# EasyEDA Pro project SMPS_V1.epro, schematic Schematic1_1
Board Name: Board1; Create Date: 2026-02-03; Page Name: HV PSU; Project Name: TL494-PSU-V1; Schematic Name: Schematic1; Update Date: 2026-02-19; Company: EasyEDA.com; Page Size: A4; Version: V1.0
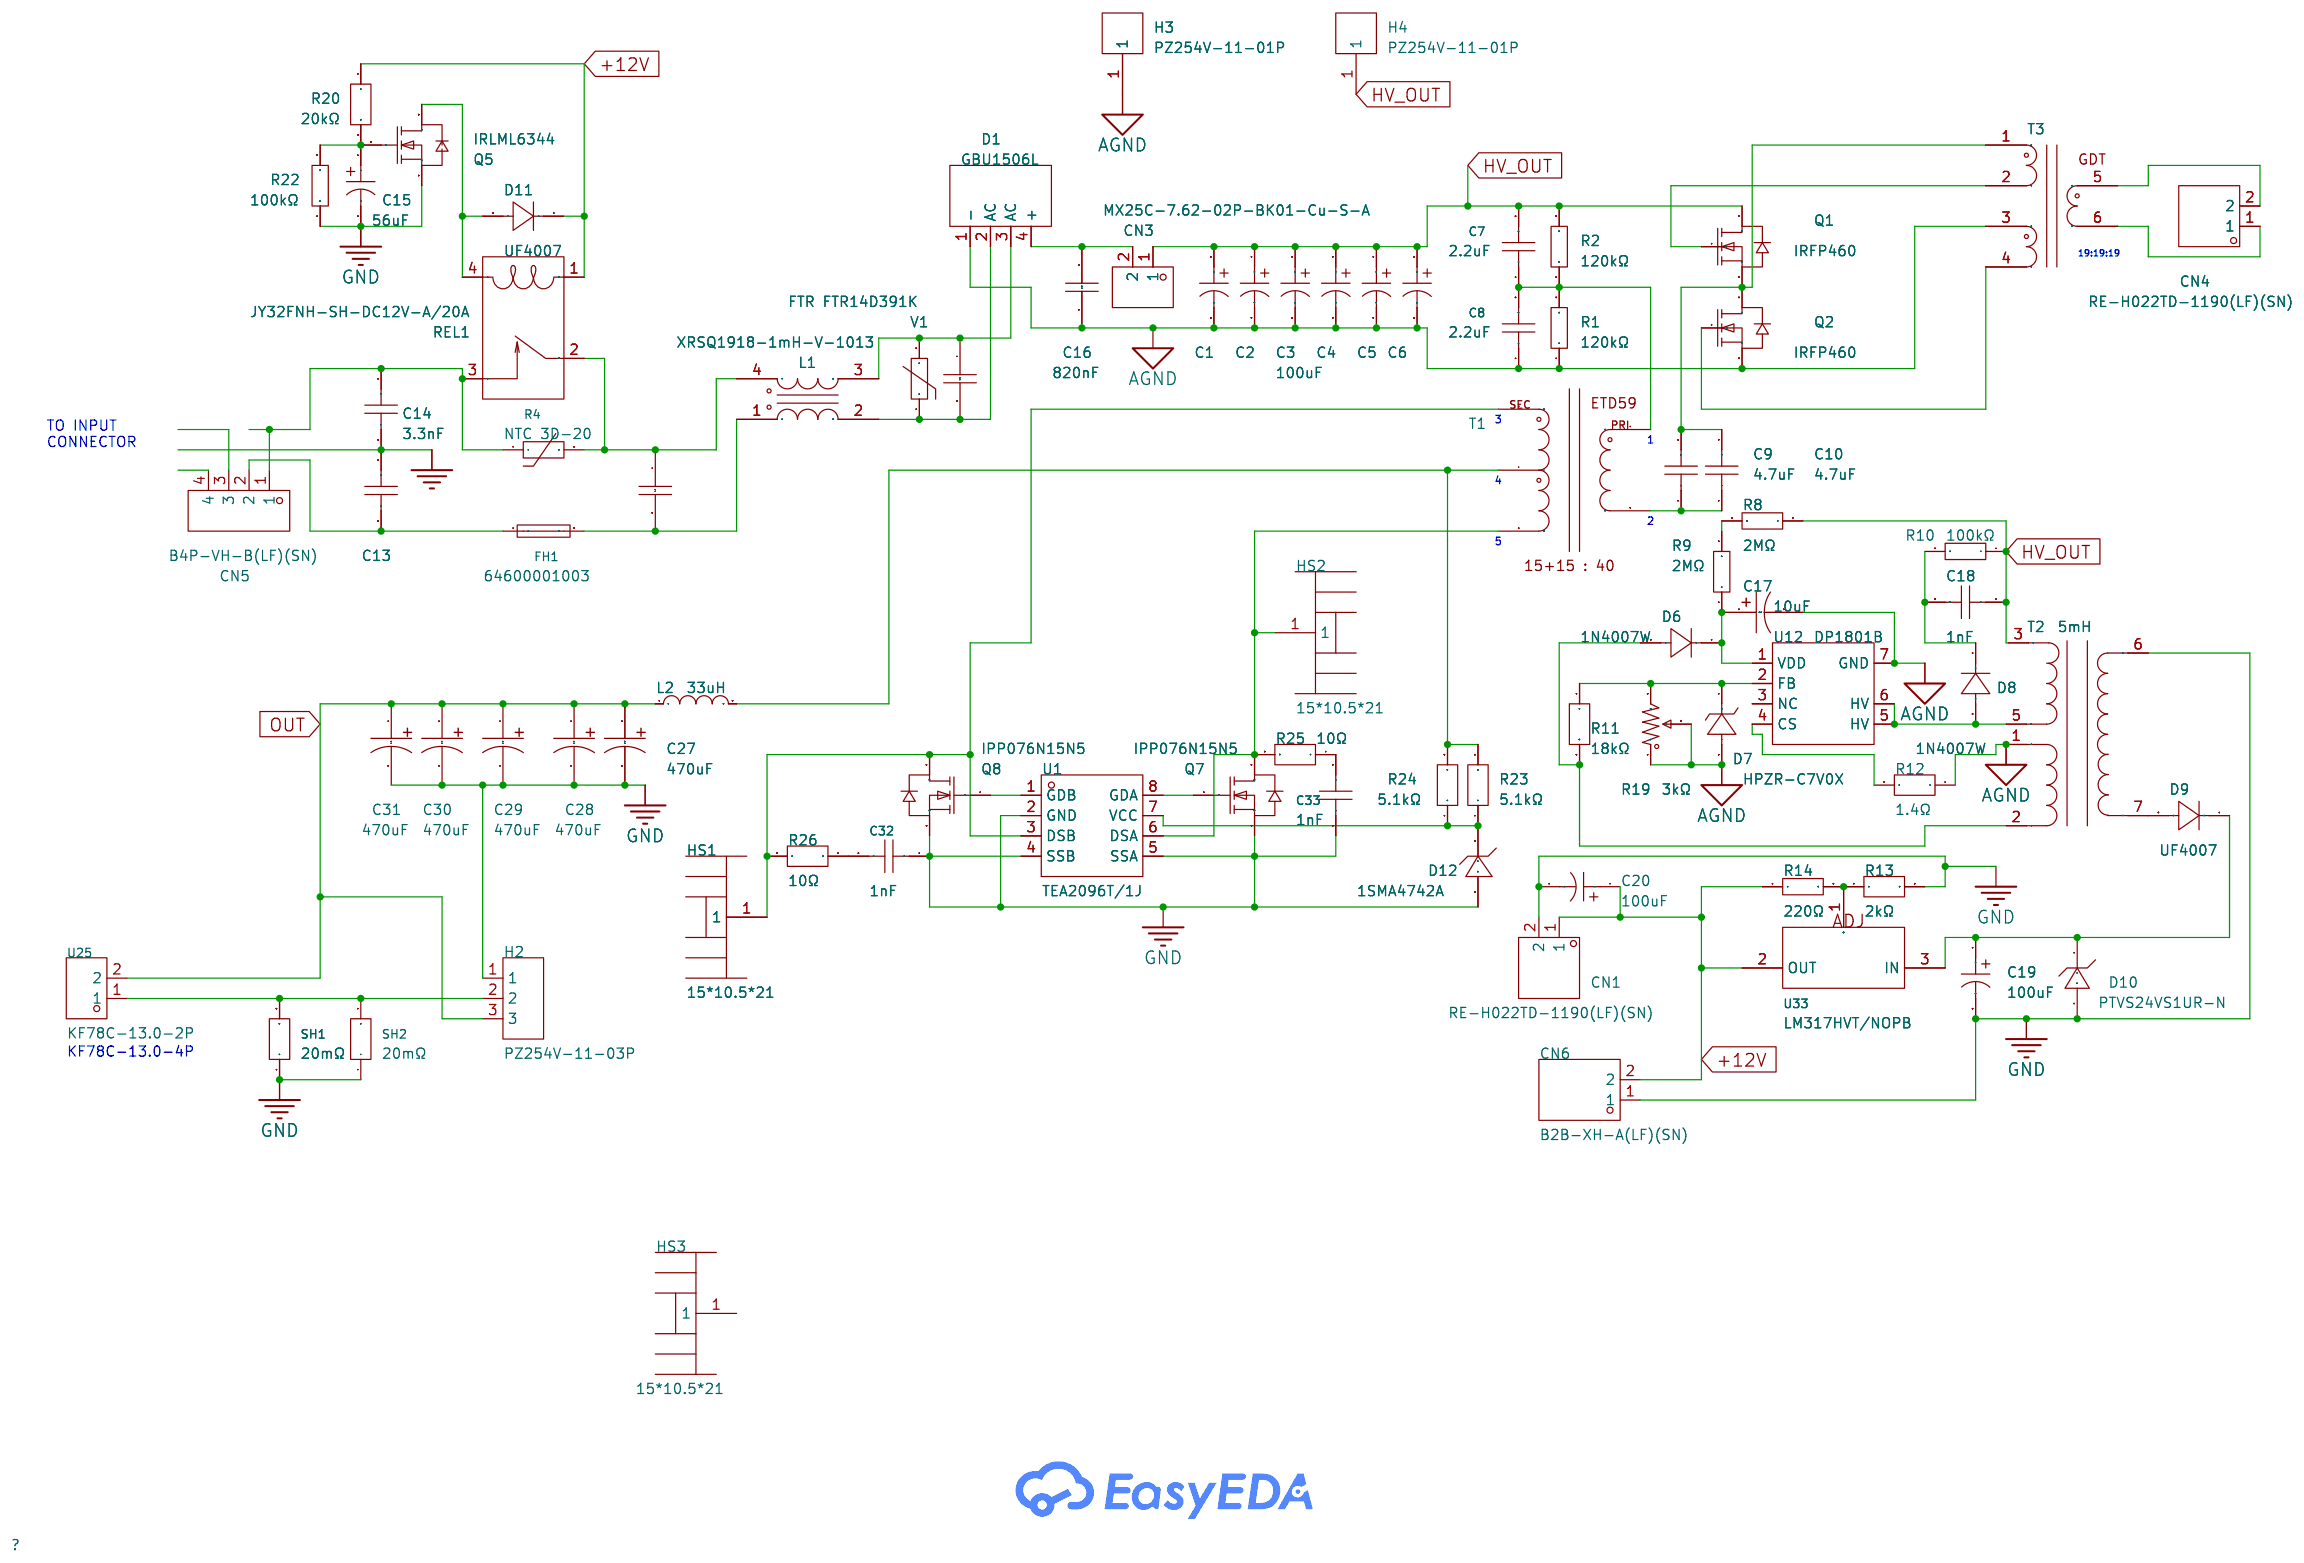
[diagram p3: schematic sheet]

## Parts
C1  100uF  [CAP-TH_BD12.5-P5.00-D0.6-FD]
C2  100uF  [CAP-TH_BD12.5-P5.00-D0.6-FD]
C3  100uF  [CAP-TH_BD12.5-P5.00-D0.6-FD]
C4  100uF  [CAP-TH_BD12.5-P5.00-D0.6-FD]
C5  100uF  [CAP-TH_BD12.5-P5.00-D0.6-FD]
C6  100uF  [CAP-TH_BD12.5-P5.00-D0.6-FD]
C7  2.2uF  [CAP-TH_L17.5-W11.1-P15.00-D1.2]
C8  2.2uF  [CAP-TH_L17.5-W11.1-P15.00-D1.2]
C9  4.7uF  [CAP-TH_L32.0-W15.0-P27.50-D0.8]
C10  4.7uF  [CAP-TH_L32.0-W15.0-P27.50-D0.8]
C11  330nF  [WALSON C42Q333446P40001]
C12  330nF  [WALSON C42Q333446P40001]
C13  3.3nF  [CAP-TH_L10.0-W4.4-P10.00-S3.8-D0.6]
C14  3.3nF  [CAP-TH_L10.0-W4.4-P10.00-S3.8-D0.6]
C15  56uF  [CAP-SMD_L7.3-W4.3-RD]
C16  820nF  [WALSON C42Q382446P60001]
C17  10uF  [CAP-TH_BD10.0-P5.00-D1.0-FD]
C18  1nF  [C0805]
C19  100uF  [CAP-SMD_BD6.3-L6.6-W6.6-LS7.3-FD]
C20  100uF  [CAP-SMD_BD6.3-L6.6-W6.6-LS7.2-FD]
C27  470uF  [CAP-TH_BD16.0-P7.50-D1.2-FD]
C28  470uF  [CAP-TH_BD16.0-P7.50-D1.2-FD]
C29  470uF  [CAP-TH_BD16.0-P7.50-D1.2-FD]
C30  470uF  [CAP-TH_BD16.0-P7.50-D1.2-FD]
C31  470uF  [CAP-TH_BD16.0-P7.50-D1.2-FD]
C32  1nF  [C0603]
C33  1nF  [C0603]
CN1  RE-H022TD-1190(LF)(SN)  [HDR-TH_2P-P2.54-V-M-1]
CN3  MX25C-7.62-02P-BK01-Cu-S-A  [CONN-TH_2P-P7.62_MAX_MX25C-7.62-BK01-02P-CU-S-A]
CN4  RE-H022TD-1190(LF)(SN)  [HDR-TH_2P-P2.54-V-M-1]
CN5  B4P-VH-B(LF)(SN)  [CONN-TH_4P-P3.96_B4P-VH-B-LF-SN]
CN6  B2B-XH-A(LF)(SN)  [CONN-TH_B2B-XH-A-LF-SN]
D1  GBU1506L  [GBU_4P-L22.0-W3.5-P5.08]
D6  1N4007W  [SOD-123FL_L2.7-W1.8-LS3.7-RD]
D7  HPZR-C7V0X  [SOD-123W_L2.8-W1.8-LS3.7-RD]
D8  1N4007W  [SOD-123FL_L2.7-W1.8-LS3.7-RD]
D9  UF4007  [DO-41_BD2.4-L4.7-P8.70-D0.9-RD]
D10  PTVS24VS1UR-N  [SOD-123_L2.6-W1.7-LS3.5-RD]
D11  UF4007  [DO-41_BD2.4-L4.7-P8.70-D0.9-RD]
D12  1SMA4742A  [SMA_L4.4-W2.8-LS5.4-RD]
FH1  64600001003  [64600001003]
H2  PZ254V-11-03P  [HDR-TH_3P-P2.54-V-M_PZ254V-11-03P]
H3  PZ254V-11-01P  [HDR-TH_1P-P2.54-V-M]
H4  PZ254V-11-01P  [HDR-TH_1P-P2.54-V-M]
HS1  15*10.5*21  [HEATSINK-TH_L15.5-W10.5-XSD1226-005]
HS2  15*10.5*21  [HEATSINK-TH_L15.5-W10.5-XSD1226-005]
HS3  15*10.5*21  [HEATSINK-TH_L15.5-W10.5-XSD1226-005]
L1  XRSQ1918-1mH-V-1013  [FILTER-TH_XRSQ1918-20MH-V-1013]
L2  33uH  [IND-TH_RSEQ32-20UH-47UH]
Q1  IRFP460  [TO-247-3_L15.9-W5.1-P5.44-L]
Q2  IRFP460  [TO-247-3_L15.9-W5.1-P5.44-L]
Q5  IRLML6344  [SOT-23-3_L3.0-W1.7-P0.95-LS2.9-BR]
Q7  IPP076N15N5  [PG-TO220-3_L10.0-W4.5-P2.54-L]
Q8  IPP076N15N5  [PG-TO220-3_L10.0-W4.5-P2.54-L]
R1  120kΩ  [RES-TH_BD3.5-L9.5-P13.50-D0.6]
R2  120kΩ  [RES-TH_BD3.5-L9.5-P13.50-D0.6]
R4  NTC 3D-20  [RES-TH_L22.0-W7.0-P7.80-D1.2-S2.00]
R8  2MΩ  [R1206]
R9  2MΩ  [R1206]
R10  100kΩ  [R1206]
R11  18kΩ  [R1206]
R12  1.4Ω  [R1210]
R13  2kΩ  [R1206]
R14  220Ω  [R1206]
R19  3kΩ  [RES-ADJ-TH_3296W]
R20  20kΩ  [R1206]
R22  100kΩ  [R1206]
R23  5.1kΩ  [R2512]
R24  5.1kΩ  [R2512]
R25  10Ω  [R1206]
R26  10Ω  [R1206]
REL1  JY32FNH-SH-DC12V-A/20A  [RELAY-TH_JY32FNH-S-DCXXV-A-10A]
SH1  20mΩ  [RES-TH_BD1.0-P5.00-D1.0]
SH2  20mΩ  [RES-TH_BD1.0-P5.00-D1.0]
T1  -  [ETD59 - 50A HPWR]  (no BOM)
T2  5mH  [XFMR-TH_XREE13-050622]
T3  -  [GDT - HPWR SMPS V1]  (no BOM)
U1  TEA2096T/1J  [SOIC-8_L5.0-W4.0-P1.27-LS6.1-BL]
U12  DP1801B  [SOP-7_L4.9-W3.9-P1.27-LS6.0-BL]
U25  KF78C-13.0-2P  [CONN-TH_KF78C-13.0-2P]
U33  LM317HVT/NOPB  [TO-220-3_L10.0-W4.5-P2.54-L]
V1  -  [RES-TH_L14.0-W5.0-P7.50-D1.0-S2.00]

## Library data of the parts
C1-C6 = KCXL4502W101MF: Capacitance:100uF Tolerance:±20% Tolerance:±20% Voltage Rating:450V Diameter:12.5mm Height - Seated (Max):45mm; LCSC Part Name: 100uF ±20% 450V; Supplier Part: C19193642; Manufacturer: Ymin(永铭); Supplier Footprint: 插件,D12.5xL45mm; JLCPCB Part Class: Extended Part; Supplier: LCSC; Tolerance: ±20%; Voltage Rating: 450V; Diameter: 12.5mm; Height - Seated (Max): 45mm
C7 C8 = ECWFD2W225JC: Capacitance:2.2uF Tolerance:±5% Tolerance:±5% Voltage Rating:450V Operating Temperature:-40℃~+110℃ Operating Temperature:-40℃~+110℃; LCSC Part Name: 2.2uF ±5% 450V; Supplier Part: C178473; Manufacturer: PANASONIC(松下); Supplier Footprint: 插件,P=15mm; JLCPCB Part Class: Extended Part; Datasheet: https://item.szlcsc.com/datasheet/ECWFD2W225JC/189866.html; Supplier: LCSC; Tolerance: ±5%; Voltage Rating: 450V; Operating Temperature: -40℃~+110℃
C9 C10 = C352J475JBSC000: Capacitance:4.7uF Tolerance:±5% Tolerance:±5% Voltage Rating:630V Operating Temperature:-55℃~+105℃ Operating Temperature:-55℃~+105℃; LCSC Part Name: 4.7uF ±5% 630V; Supplier Part: C19189618; Manufacturer: faratronic(厦门法拉); Supplier Footprint: 插件,P=27.5mm; JLCPCB Part Class: Extended Part; Datasheet: https://item.szlcsc.com/datasheet/C352J475JBSC000/20418291.html; Supplier: LCSC; Tolerance: ±5%; Voltage Rating: 630V; Operating Temperature: -55℃~+105℃
C11 C12 = WALSON C42Q333446P40001: Manufacturer: WALSON; Supplier Part: C46638868; Supplier: LCSC; Datasheet: https://www.lcsc.com/datasheet/C46638868.pdf; Part Number: C42Q333446P40001
C13 C14 = CY1332ME1IEF48O2A2: Capacitance:3.3nF Tolerance:±20% Tolerance:±20% Voltage(AC):400V Ratings:Y1 safety certification:CQC；CUL；UL；ENEC；VDE Operating Temperature:-40℃~+125℃ Operating Temperature:-40℃~+125℃; LCSC Part Name: 等级:Y1 3300pF ±20% 400V; Supplier Part: C2761711; Manufacturer: Dersonic(德尔创); Supplier Footprint: 插件,P=10mm; JLCPCB Part Class: Extended Part; Datasheet: https://item.szlcsc.com/datasheet/CY1332ME1IEF48O2A2/2886458.html; Supplier: LCSC; Tolerance: ±20%; Voltage(AC): 400V; Ratings: Y1; safety certification: CQC；CUL；UL；ENEC；VDE; Operating Temperature: -40℃~+125℃
C15 = EEFCX1D560R: Capacitance:56uF Tolerance:±20% Tolerance:±20% Voltage Rating:20V Type:Polymer Diameter:7.3mm Height - Seated (Max):4.3mm Operating Temperature:-55℃~+105℃ Operating Temperature:-55℃~+105℃; LCSC Part Name: 56uF ±20% 20V; Supplier Part: C465937; Manufacturer: PANASONIC(松下); Supplier Footprint: SMD,D7.3xL4.3mm; JLCPCB Part Class: Extended Part; Datasheet: https://item.szlcsc.com/datasheet/EEFCX1D560R/471270.html; Supplier: LCSC; Tolerance: ±20%; Voltage Rating: 20V; Type: Polymer; Diameter: 7.3mm; Height - Seated (Max): 4.3mm; Operating Temperature: -55℃~+105℃
C16 = WALSON C42Q382446P60001: Height: 19mm; Manufacturer: WALSON; Manufacturer Part: C42Q382446P60001; Supplier: LCSC; Supplier Part: C46638880
C17 = ECG2GM100G12OTBO: Capacitance:10uF Tolerance:±20% Tolerance:±20% Voltage Rating:400V Ripple Current:230mA@100kHz Equivalent Series Resistance(ESR):- Pin Spacing:5mm Diameter:10mm Height - Seated (Max):12mm Lifetime:8000hrs@105℃; LCSC Part Name: 10uF ±20% 400V; Supplier Part: C711629; Manufacturer: Yunxing(云星); Supplier Footprint: 插件,D10xL12mm; JLCPCB Part Class: Extended Part; Datasheet: https://atta.szlcsc.com/upload/public/pdf/source/20200506/C525419_5DB4C0F9B5E6E2AFEBB1800A1F09D9CB.pdf; Supplier: LCSC; Tolerance: ±20%; Voltage Rating: 400V; Ripple Current: 230mA@100kHz; Pin Spacing: 5mm; Diameter: 10mm; Height - Seated (Max): 12mm; Lifetime: 8000hrs@105℃
C18 = CC0805KRX7RCBB102: Capacitance:1nF Tolerance:±10% Tolerance:±10% Voltage Rating:1kV Temperature Coefficient:X7R; LCSC Part Name: 1nF ±10% 1kV; Supplier Part: C309495; Manufacturer: YAGEO(国巨); Supplier Footprint: 0805; JLCPCB Part Class: Extended Part; Datasheet: https://item.szlcsc.com/datasheet/CC0805KRX7RCBB102/293111.html; Supplier: LCSC; Tolerance: ±10%; Voltage Rating: 1kV; Temperature Coefficient: X7R
C19 = 126RV0112: Capacitance:100uF Tolerance:±20% Tolerance:±20% Voltage Rating:50V Ripple Current:120mA Diameter:6.3mm Height - Seated (Max):7.7mm Lifetime:2000hrs@105℃ Operating Temperature:-55℃~+105℃ Operating Temperature:-55℃~+105℃; LCSC Part Name: 100uF ±20% 50V; Supplier Part: C7461243; Manufacturer: KNSCHA(科尼盛); Supplier Footprint: SMD,D6.3xL7.7mm; JLCPCB Part Class: Extended Part; Datasheet: https://item.szlcsc.com/datasheet/126RV0112/8488771.html; Supplier: LCSC; Tolerance: ±20%; Voltage Rating: 50V; Ripple Current: 120mA; Diameter: 6.3mm; Height - Seated (Max): 7.7mm; Lifetime: 2000hrs@105℃; Operating Temperature: -55℃~+105℃
C20 = RVT100UF16V67RV0016: Capacitance:100uF Tolerance:±20% Tolerance:±20% Voltage Rating:16V Ripple Current:93mA@120Hz Equivalent Series Resistance(ESR):- Diameter:6.3mm Height - Seated (Max):5.4mm Lifetime:2000hrs@105℃ Operating Temperature:-55℃~+105℃ Operating Temperature:-55℃~+; LCSC Part Name: 100uF ±20% 16V; Supplier Part: C2887276; Manufacturer: KNSCHA(科尼盛); Supplier Footprint: SMD,D6.3xL5.4mm; JLCPCB Part Class: Extended Part; Datasheet: https://item.szlcsc.com/datasheet/RVT100UF16V67RV0016/3103844.html; Supplier: LCSC; Tolerance: ±20%; Voltage Rating: 16V; Ripple Current: 93mA@120Hz; Diameter: 6.3mm; Height - Seated (Max): 5.4mm; Lifetime: 2000hrs@105℃; Operating Temperature: -55℃~+105℃
C27-C31 = ERS1KM471L25OT: Capacitance:470uF Tolerance:±20% Tolerance:±20% Voltage Rating:100V Ripple Current:- Equivalent Series Resistance(ESR):- Pin Spacing:- Diameter:16mm Height - Seated (Max):25mm Lifetime:- Operating Temperature:-40℃~+105℃ Operating Temperature:-40℃~+105℃; LCSC Part Name: 470uF ±20% 100V; Supplier Part: C721247; Manufacturer: AISHI(艾华集团); Supplier Footprint: 插件,D16xL25mm; JLCPCB Part Class: Extended Part; Datasheet: https://item.szlcsc.com/datasheet/ERS1KM471L25OT/764996.html; Supplier: LCSC; Tolerance: ±20%; Voltage Rating: 100V; Diameter: 16mm; Height - Seated (Max): 25mm; Operating Temperature: -40℃~+105℃
C32 C33 = CC0603KRX7RYBB102: Capacitance:1nF Tolerance:±10% Tolerance:±10% Voltage Rating:250V Temperature Coefficient:X7R; LCSC Part Name: 1nF ±10% 250V; Supplier Part: C277510; Manufacturer: YAGEO(国巨); Supplier Footprint: 0603; JLCPCB Part Class: Extended Part; Datasheet: https://item.szlcsc.com/datasheet/CC0603KRX7RYBB102/264829.html; Supplier: LCSC; Tolerance: ±10%; Voltage Rating: 250V; Temperature Coefficient: X7R
CN1 CN4 = RE-H022TD-1190(LF)(SN): Pins Structure:1x2P Pitch:2.54mm Mounting Type:Through Hole Number of Pins:2P Number of Rows:1 Number of PINs Per Row:2 Current Rating:3A Contact Material:Brass Operating Temperature:-55℃~+125℃ Operating Temperature:-55℃~+125℃ Voltage Rating:250V Plastic; LCSC Part Name: 1x2P 间距:2.54mm 直插; Supplier Part: C160332; Manufacturer: JST; Supplier Footprint: 插件,P=2.54mm; JLCPCB Part Class: Extended Part; Datasheet: https://item.szlcsc.com/datasheet/RE-H022TD-1190(LF)(SN)/171712.html; Supplier: LCSC; Pins Structure: 1x2P; Pitch: 2.54mm; Mounting Type: Through Hole; Number of Pins: 2P; Number of Rows: 1; Number of PINs Per Row: 2; Current Rating: 3A; Contact Material: Brass; Operating Temperature: -55℃~+125℃; Voltage Rating: 250V; Plastic Material: PBT; Flame Retardant Rating: UL94V-0; Color: Black
CN3 = MX25C-7.62-02P-BK01-Cu-S-A: Barrier Type:2-Side Pitch:7.62mm Number of Positions or Pins:1x2P Mounting Type:Straight Pin Location:Mid Terminal Number of Pins:2P Number of Rows:1 Number of PINs Per Row:2 Screw Specification:M3 Current Rating:15A Voltage Rating (Max):300V Wire Gauge -; LCSC Part Name: 7.62mm 1x2P 直插 中脚 排数:1 每排P数:2; Supplier Part: C5188509; Manufacturer: MAX(迈旭); Supplier Footprint: 插件,P=7.62mm; JLCPCB Part Class: Extended Part; Datasheet: https://item.szlcsc.com/datasheet/MX25C-7.62-02P-BK01-Cu-S-A/5862593.html; Supplier: LCSC; Barrier Type: 2-Side; Pitch: 7.62mm; Number of Positions or Pins: 1x2P; Mounting Type: Straight; Pin Location: Mid Terminal; Number of Pins: 2P; Number of Rows: 1; Number of PINs Per Row: 2; Screw Specification: M3; Current Rating: 15A; Voltage Rating (Max): 300V; Wire Gauge - AWG: 14~22; Wire Gauge - mm2: 1.5; Operating Temperature: -40℃~+105℃; Color: Black
CN5 = B4P-VH-B(LF)(SN): Pins Structure:1x4P Pitch:3.96mm Mounting Style:Direct Insert Reference Series:VH Number of Pins:4P Number of Rows:1 Number of PINs Per Row:4 Row Spacing:- Current Rating (Max):10A Contact Material:Brass Contact Plating:Tin Operating Temperature Range:-25; LCSC Part Name: 1x4P 间距:3.96mm 直插 系列:VH; Supplier Part: C493148; Manufacturer: JST; Supplier Footprint: 插件,P=3.96mm; JLCPCB Part Class: Extended Part; Datasheet: https://atta.szlcsc.com/upload/public/pdf/source/20220208/ECAA58BC68B23E29E576C700CFB0AF43.pdf; Supplier: LCSC; Pins Structure: 1x4P; Pitch: 3.96mm; Mounting Style: Direct Insert; Reference Series: VH; Number of Pins: 4P; Number of Rows: 1; Number of PINs Per Row: 4; Current Rating (Max): 10A; Contact Material: Brass; Contact Plating: Tin; Operating Temperature Range: -25℃~+85℃; Rated Voltage (Max): 250V; Plastic Material: Glass Fiber Reinforced PBT; Flame Retardant Rating: UL94V-0; Colour: White; Z-Height of the Board: 9.4mm; X-Length of Bottom Edge on Board (Spacing Line): 15.78mm; Y-Width of Bottom Edge on Board: 8.5mm
CN6 = B2B-XH-A(LF)(SN): Pins Structure:1x2P Pitch:2.5mm Mounting Type:Through Hole Reference Series:XH Number of Pins:2P Number of Rows:1 Number of PINs Per Row:2 Row Spacing:- Current Rating:3A Contact Material:Brass Contact Plating:Tin Operating Temperature:-25℃~+85℃ Operating; LCSC Part Name: 1x2P 间距:2.5mm 直插 系列:XH; Supplier Part: C158012; Manufacturer: JST; Supplier Footprint: 插件,P=2.5mm; JLCPCB Part Class: Extended Part; Datasheet: https://item.szlcsc.com/datasheet/B2B-XH-A(LF)(SN)/169360.html; Supplier: LCSC; Pins Structure: 1x2P; Pitch: 2.5mm; Mounting Type: Through Hole; Reference Series: XH; Number of Pins: 2P; Number of Rows: 1; Number of PINs Per Row: 2; Current Rating: 3A; Contact Material: Brass; Contact Plating: Tin; Operating Temperature: -25℃~+85℃; Voltage Rating: 250V; Plastic Material: PA66; Flame Retardant Rating: UL94V-0; Supplementary Features: K Pin; Color: White; Z-Height of the Board: 7mm; X-Length of Bottom Edge on Board (Spacing Line): 7.4mm; Y-Width of Bottom Edge on Board: 5.75mm
D1 = GBU1510_C350460: Forward Voltage (Vf@If):900mV@15A Reverse Voltage (Vr): Rectified Current: Reverse Leakage Current (Ir):5uA@600V Peak Forward Surge Current: Operating Temperature:-55℃~+150℃@(Tj) Operating Temperature:-55℃~+150℃@(Tj); Supplier Part: C49326439; Manufacturer: XUMAO; Supplier Footprint: GBU; JLCPCB Part Class: Extended Part; Datasheet: https://atta.szlcsc.com/upload/public/pdf/source/20190115/C350460_808B5E29F59959D047D79C3B6590DA46.pdf; Supplier: LCSC; Forward Voltage (Vf@If): 900mV@15A; Reverse Leakage Current (Ir): 5uA@600V; Operating Temperature: -55℃~+150℃
D6 D8 = 1N4007W_C7528871: Diode Configuration:Independent Voltage - Forward(Vf@If):1.1V@1A Voltage - DC Reverse(Vr):1kV Current - Rectified:1A Reverse Leakage Current (Ir):10uA Operating Junction Temperature Range:-65℃~+150℃ Operating Junction Temperature Range:-65℃~+150℃; Supplier Part: C7528871; Manufacturer: MSKSEMI(美森科); Supplier Footprint: SOD-123FL; JLCPCB Part Class: Extended Part; Datasheet: https://item.szlcsc.com/datasheet/1N4007W/8628271.html; Supplier: LCSC; Diode Configuration: Independent; Voltage - Forward(Vf@If): 1.1V@1A; Voltage - DC Reverse(Vr): 1kV; Current - Rectified: 1A; Reverse Leakage Current (Ir): 10uA; Operating Junction Temperature Range: -65℃~+150℃
D7 = HPZR-C7V0X: Diode Configuration:Independent Zener Voltage(Nom):7V Reverse Leakage Current (Ir):400uA@6V Zener Voltage(Range):6.67V~7.37V Zener Voltage(Range):6.67V~7.37V Pd - Power Dissipation:962mW Impedance(Zzt):4.77Ω; LCSC Part Name: 7V 400uA@6V; Supplier Part: C6631882; Manufacturer: Nexperia(安世); Supplier Footprint: SOD-123W; JLCPCB Part Class: Extended Part; Datasheet: https://item.szlcsc.com/datasheet/HPZR-C7V0X/7586847.html; Supplier: LCSC; Diode Configuration: Independent; Zener Voltage(Nom): 7V; Reverse Leakage Current (Ir): 400uA@6V; Zener Voltage(Range): 6.67V~7.37V; Pd - Power Dissipation: 962mW; Impedance(Zzt): 4.77Ω
D9 D11 = UF4007_C960666: Diode Configuration:- Voltage - Forward(Vf@If):1.7V@1A Voltage - DC Reverse(Vr):1kV Current - Rectified:1A Reverse Leakage Current (Ir):5uA@1kV Reverse Recovery Time (trr):75ns Operating Junction Temperature Range:-50℃~+150℃@(Tj) Operating Junction Temper; LCSC Part Name: 耐压:1kV 电流:1A 反向恢复时间：75ns; Supplier Part: C960666; Manufacturer: MDD(辰达半导体); Supplier Footprint: DO-41; JLCPCB Part Class: Extended Part; Datasheet: https://item.szlcsc.com/datasheet/UF4007/1039942.html; Supplier: LCSC; Voltage - Forward(Vf@If): 1.7V@1A; Voltage - DC Reverse(Vr): 1kV; Current - Rectified: 1A; Reverse Leakage Current (Ir): 5uA@1kV; Reverse Recovery Time (trr): 75ns; Operating Junction Temperature Range: -50℃~+150℃@(Tj); Non-Repetitive Peak Forward Surge Current: 30A
D10 = PTVS24VS1UR-N: Polarity:Unidirectional Reverse Stand-Off Voltage (Vrwm):24V Clamping Voltage:45V@90A Peak Pulse Current (Ipp):90A Peak Pulse Power Dissipation (Ppp):4.5kW Voltage - Breakdown:26.7V Reverse Leakage Current (Ir):500nA Number of Channels:1 level of protecti; LCSC Part Name: 单向TVS 24V截止 峰值浪涌电流：90A; Supplier Part: C5148487; Manufacturer: BORN(伯恩半导体); Supplier Footprint: SOD-123FL; JLCPCB Part Class: Extended Part; Datasheet: https://item.szlcsc.com/datasheet/PTVS24VS1UR-N/5771556.html; Supplier: LCSC; Polarity: Unidirectional; Reverse Stand-Off Voltage (Vrwm): 24V; Clamping Voltage: 45V@90A; Peak Pulse Current (Ipp): 90A; Peak Pulse Power Dissipation (Ppp): 4.5kW; Voltage - Breakdown: 26.7V; Reverse Leakage Current (Ir): 500nA; Number of Channels: 1; level of protection: IEC 61000-4-4；IEC 61000-4-5；IEC 61000-4-2; Type: TVS; Junction Capacitance: 560pF
D12 = 1SMA4742A_C173481: Diode Configuration:Independent Zener Voltage(Nom):12V Reverse Leakage Current (Ir):5uA Zener Voltage(Range):11.4V~12.6V Zener Voltage(Range):11.4V~12.6V Pd - Power Dissipation:1W Impedance(Zzt):9Ω Operating Junction Temperature Range:-55℃~+150℃ Operating; Supplier Part: C173481; Manufacturer: MDD(辰达半导体); Supplier Footprint: SMA(DO-214AC); JLCPCB Part Class: Extended Part; Datasheet: https://item.szlcsc.com/datasheet/1SMA4742A/184870.html; Supplier: LCSC; Diode Configuration: Independent; Zener Voltage(Nom): 12V; Reverse Leakage Current (Ir): 5uA; Zener Voltage(Range): 11.4V~12.6V; Pd - Power Dissipation: 1W; Impedance(Zzt): 9Ω; Operating Junction Temperature Range: -55℃~+150℃
FH1 = 64600001003: Fuseholder Type:Bracket type Number of Circuits:1 Voltage Rating:250V Current Rating:6.3A Fuse Type:Cylindrical Fuse Diameter (φD):5mm Fuse Length:20mm; LCSC Part Name: 6.3A 250V 支座型; Supplier Part: C206887; Manufacturer: Littelfuse(美国力特); Supplier Footprint: 插件; JLCPCB Part Class: Extended Part; Datasheet: https://item.szlcsc.com/datasheet/64600001003/208006.html; Supplier: LCSC; Fuseholder Type: Bracket type; Number of Circuits: 1; Voltage Rating: 250V; Current Rating: 6.3A; Fuse Type: Cylindrical; Fuse Diameter (φD): 5mm; Fuse Length: 20mm
H2 = PZ254V-11-03P: Pin Structure:1x3P Pitch:2.54mm Row Spacing:- Circluar Pins/Square Pins:Pin Header Mounting Type:Through Hole Number of Rows:1 Number of Pins:3P Current Rating:3A Voltage Rating (Max):250V Length of Mating Pin:6mm Insulation Height:2.5mm Length of End Con; LCSC Part Name: 1x3P 间距:2.54mm 方针 直插; Supplier Part: C2937625; Manufacturer: XFCN(兴飞); Supplier Footprint: 插件,P=2.54mm; JLCPCB Part Class: Extended Part; Datasheet: https://item.szlcsc.com/datasheet/PZ254V-11-03P/3293280.html; Supplier: LCSC; Pin Structure: 1x3P; Pitch: 2.54mm; Circluar Pins/Square Pins: Pin Header; Mounting Type: Through Hole; Number of Rows: 1; Number of Pins: 3P; Current Rating: 3A; Voltage Rating (Max): 250V; Length of Mating Pin: 6mm; Insulation Height: 2.5mm; Length of End Connection Pin: 3mm; Operating Temperature: -40℃~+105℃; Color: Black
H3 H4 = PZ254V-11-01P: Pin Structure:1x1P Pitch:2.54mm Row Spacing:- Circluar Pins/Square Pins:Pin Header Mounting Type:Through Hole Number of Rows:1 Number of Pins:1P Current Rating:- Voltage Rating (Max):- Length of Mating Pin:6mm Insulation Height:2.5mm Length of End Connect; LCSC Part Name: 1x1P 间距:2.54mm 方针 直插; Supplier Part: C492400; Manufacturer: XFCN(兴飞); Supplier Footprint: 插件,P=2.54mm; JLCPCB Part Class: Extended Part; Datasheet: https://item.szlcsc.com/datasheet/PZ254V-11-01P/502956.html; Supplier: LCSC; Pin Structure: 1x1P; Pitch: 2.54mm; Circluar Pins/Square Pins: Pin Header; Mounting Type: Through Hole; Number of Rows: 1; Number of Pins: 1P; Length of Mating Pin: 6mm; Insulation Height: 2.5mm; Length of End Connection Pin: 3mm; Contact Material: Brass; Operating Temperature: -40℃~+105℃; Color: Black
HS1-HS3 = 15*10.5*21: ProductSize:15.5*10.5*21MM Colour:Black TextureOfMaterial:6063-T5 SurfaceTreatment:Black Oxide Shape:H-Type NumberOfHoles:- NumberOfTeeth:-; LCSC Part Name: XSD(鑫顺达)to-220二极管铝型材散热片 15.5*10.5*21 黑色带针大功率电子散热器（可定制）; Supplier Part: C116600; Manufacturer: XSD(鑫顺达); JLCPCB Part Class: Extended Part; Datasheet: https://item.szlcsc.com/datasheet/15*10.5*21/117854.html; Supplier: LCSC; ProductSize: 15.5*10.5*21MM; Colour: Black; TextureOfMaterial: 6063-T5; SurfaceTreatment: Black Oxide; Shape: H-Type
L1 = XRSQ1918-1mH-V-1013: Number of Lines:2 Voltage Withstand:1.5kV Current Rating:10A Inductance @ Frequency:1mH@1kHZ DC Resistance(DCR):20mΩ; LCSC Part Name: SQ1918-1mH  立式 13*10  0.7* 1.5线; Supplier Part: C41368814; Manufacturer: XR(祥如); Supplier Footprint: 插件-4P,24x15mm; JLCPCB Part Class: Extended Part; Datasheet: https://item.szlcsc.com/datasheet/XRSQ1918-1mH-V-1013/43126304.html; Supplier: LCSC; Number of Lines: 2; Voltage Withstand: 1.5kV; Current Rating: 10A; Inductance @ Frequency: 1mH@1kHZ; DC Resistance(DCR): 20mΩ
L2 = RSEQ32-330M: Inductance:33uH Tolerance:±20% Tolerance:±20% Current Rating:40A Current - Saturation(Isat):42A DC Resistance(DCR):0.9mΩ Type:Flat Wire Inductor; LCSC Part Name: 扁线大电流电感; Supplier Part: C37634009; Manufacturer: Ruishen(瑞申电子); Supplier Footprint: 插件,33x31.5mm; JLCPCB Part Class: Extended Part; Datasheet: https://item.szlcsc.com/datasheet/RSEQ32-330M/39358272.html; Supplier: LCSC; Tolerance: ±20%; Current Rating: 40A; Current - Saturation(Isat): 42A; DC Resistance(DCR): 0.9mΩ; Type: Flat Wire Inductor
Q1 Q2 = IRFP460_C22389973: LCSC Part Name: N沟道20A 500V; Supplier Part: C22389973; Manufacturer: minos(迈诺斯); Supplier Footprint: TO-247; JLCPCB Part Class: Extended Part; Datasheet: https://atta.szlcsc.com/upload/public/pdf/source/20240425/7FEF0AD281DA18A3AE3A6EE2E867B3B9.pdf; Supplier: LCSC
Q5 = IRLML6344: Number:One N-channel Drain to Source Voltage:30V Current - Continuous Drain(Id):5A RDS(on):29mΩ@4.5V,5A Pd - Power Dissipation:1.3W Gate Threshold Voltage (Vgs(th)):1.1V Gate Charge(Qg):6.8nC@4.5V Input Capacitance(Ciss):650pF@25V Reverse Transfer Capacit; LCSC Part Name: 1个N沟道 耐压:30V 电流:5A; Supplier Part: C5364313; Manufacturer: Hottech(合科泰); Supplier Footprint: SOT-23; JLCPCB Part Class: Extended Part; Datasheet: https://item.szlcsc.com/datasheet/IRLML6344/6193391.html; Supplier: LCSC; Number: One N-channel; Drain to Source Voltage: 30V; Current - Continuous Drain(Id): 5A; RDS(on): 29mΩ@4.5V,5A; Pd - Power Dissipation: 1.3W; Gate Threshold Voltage (Vgs(th)): 1.1V; Gate Charge(Qg): 6.8nC@4.5V; Input Capacitance(Ciss): 650pF@25V; Reverse Transfer Capacitance (Crss@Vds): 46pF@15V; Operating Temperature: -55℃~+150℃
Q7 Q8 = IPP076N15N5: Number:1 N-channel Drain to Source Voltage:150V Current - Continuous Drain(Id):112A RDS(on):7.6mΩ@10V,56A Pd - Power Dissipation:214W Gate Threshold Voltage (Vgs(th)):4.6V Gate Charge(Qg):- Input Capacitance(Ciss):4.7nF@75V Reverse Transfer Capacitance (C; LCSC Part Name: 1个N沟道 耐压:150V 电流:112A; Supplier Part: C537145; Manufacturer: Infineon(英飞凌); Supplier Footprint: TO-220-3; JLCPCB Part Class: Extended Part; Datasheet: https://item.szlcsc.com/datasheet/IPP076N15N5/557558.html; Supplier: LCSC; Number: 1 N-channel; Drain to Source Voltage: 150V; Current - Continuous Drain(Id): 112A; RDS(on): 7.6mΩ@10V,56A; Pd - Power Dissipation: 214W; Gate Threshold Voltage (Vgs(th)): 4.6V; Input Capacitance(Ciss): 4.7nF@75V; Reverse Transfer Capacitance (Crss@Vds): 37pF@75V; Operating Temperature: -55℃~+175℃
R1 R2 = MO1WS-120K±5%-2T52: Type:Metal Oxide Film Resistor Resistance:120kΩ Tolerance:±5% Tolerance:±5% Voltage-Supply(Max):350V Power(Watts):1W Temperature Coefficient:±350ppm/℃ Temperature Coefficient:±350ppm/℃ Operating Temperature:-55℃~+155℃ Operating Temperature:-55℃~+155℃; LCSC Part Name: 金属氧化膜电阻 120kΩ ±5% 1W; Supplier Part: C479440; Manufacturer: VO(翔胜); Supplier Footprint: 插件,D3.5xL9mm; JLCPCB Part Class: Extended Part; Datasheet: https://item.szlcsc.com/datasheet/MO1WS-120K%25C2%25B15%2525-2T52/486809.html; Supplier: LCSC; Type: Metal Oxide Film Resistor; Tolerance: ±5%; Voltage-Supply(Max): 350V; Power(Watts): 1W; Temperature Coefficient: ±350ppm/℃; Operating Temperature: -55℃~+155℃
R4 = NTC 3D-20: Resistance @ 25℃:3Ω B Constant (25℃/50℃):2700K B Constant (25℃/75℃):2700K B Constant (25℃/85℃):2700K B Constant (25℃/100℃):2700K Power(Watts):4W B Constant Tolerance:±10% Steady State Current (Max):8A Operating Temperature:-40℃~+200℃ Operating Temperature; Supplier Part: C2841043; Manufacturer: RUILON(瑞隆源); Supplier Footprint: 插件,P=10mm; JLCPCB Part Class: Extended Part; Datasheet: https://item.szlcsc.com/datasheet/NTC%25203D-20/3022351.html; Supplier: LCSC; Resistance @ 25℃: 3Ω; B Constant (25℃/50℃): 2700K; B Constant (25℃/75℃): 2700K; B Constant (25℃/85℃): 2700K; B Constant (25℃/100℃): 2700K; Power(Watts): 4W; B Constant Tolerance: ±10%; Steady State Current (Max): 8A; Operating Temperature: -40℃~+200℃
R8 R9 = RC1206FR-072ML: Type:Thick Film Resistor Resistance:2MΩ Tolerance:±1% Tolerance:±1% Power(Watts):250mW Voltage-Supply(Max):200V Temperature Coefficient:±100ppm/℃ Temperature Coefficient:±100ppm/℃ Operating Temperature:-55℃~+155℃ Operating Temperature:-55℃~+155℃; LCSC Part Name: 厚膜电阻 2MΩ ±1% 250mW; Supplier Part: C137328; Manufacturer: YAGEO(国巨); Supplier Footprint: 1206; JLCPCB Part Class: Extended Part; Datasheet: https://item.szlcsc.com/datasheet/RC1206FR-072ML/148644.html; Supplier: LCSC; Type: Thick Film Resistor; Tolerance: ±1%; Power(Watts): 250mW; Voltage-Supply(Max): 200V; Temperature Coefficient: ±100ppm/℃; Operating Temperature: -55℃~+155℃
R10 R22 = RC1206FR-07100KL: Type:Thick Film Resistor Resistance:100kΩ Tolerance:±1% Tolerance:±1% Power(Watts):250mW Voltage-Supply(Max):200V Temperature Coefficient:±100ppm/℃ Temperature Coefficient:±100ppm/℃ Operating Temperature:-55℃~+155℃ Operating Temperature:-55℃~+155℃; LCSC Part Name: 厚膜电阻 100kΩ ±1% 250mW; Supplier Part: C137393; Manufacturer: YAGEO(国巨); Supplier Footprint: 1206; JLCPCB Part Class: Extended Part; Datasheet: https://item.szlcsc.com/datasheet/RC1206FR-07100KL/148709.html; Supplier: LCSC; Type: Thick Film Resistor; Tolerance: ±1%; Power(Watts): 250mW; Voltage-Supply(Max): 200V; Temperature Coefficient: ±100ppm/℃; Operating Temperature: -55℃~+155℃
R11 = FRC1206J183 TS: Type:Thick Film Resistor Resistance:18kΩ Tolerance:±5% Tolerance:±5% Power(Watts):250mW Voltage-Supply(Max):200V Temperature Coefficient:±100ppm/℃ Temperature Coefficient:±100ppm/℃ Operating Temperature:-55℃~+155℃ Operating Temperature:-55℃~+155℃; LCSC Part Name: 18kΩ ±5% 250mW 厚膜电阻; Supplier Part: C2907438; Manufacturer: FOJAN(富捷); Supplier Footprint: 1206; JLCPCB Part Class: Extended Part; Supplier: LCSC; Type: Thick Film Resistor; Tolerance: ±5%; Power(Watts): 250mW; Voltage-Supply(Max): 200V; Temperature Coefficient: ±100ppm/℃; Operating Temperature: -55℃~+155℃
R12 = 1210W2F140KT5E: Type:Thick Film Resistors Resistance:1.4Ω Tolerance:±1% Tolerance:±1% Power(Watts):0.5W Voltage-Supply(Max):200V Temperature Coefficient:±200ppm/℃ Temperature Coefficient:±200ppm/℃ Operating Temperature:-55℃~+155℃ Operating Temperature:-55℃~+155℃; LCSC Part Name: 1.4Ω ±1% 500mW 厚膜电阻; Supplier Part: C2768077; Manufacturer: UNI-ROYAL(厚声); Supplier Footprint: 1210; JLCPCB Part Class: Extended Part; Datasheet: https://atta.szlcsc.com/upload/public/pdf/source/20200306/C422600_1E6D84923E4A46A82E41ADD87F860B5C.pdf; Supplier: LCSC; Type: Thick Film Resistors; Tolerance: ±1%; Power(Watts): 0.5W; Voltage-Supply(Max): 200V; Temperature Coefficient: ±200ppm/℃; Operating Temperature: -55℃~+155℃
R13 = FRC1206J202 TS: Type:Thick Film Resistor Resistance:2kΩ Tolerance:±5% Tolerance:±5% Power(Watts):250mW Voltage-Supply(Max):200V Temperature Coefficient:±100ppm/℃ Temperature Coefficient:±100ppm/℃ Operating Temperature:-55℃~+155℃ Operating Temperature:-55℃~+155℃; LCSC Part Name: 2kΩ ±5% 250mW 厚膜电阻; Supplier Part: C2907466; Manufacturer: FOJAN(富捷); Supplier Footprint: 1206; JLCPCB Part Class: Extended Part; Supplier: LCSC; Type: Thick Film Resistor; Tolerance: ±5%; Power(Watts): 250mW; Voltage-Supply(Max): 200V; Temperature Coefficient: ±100ppm/℃; Operating Temperature: -55℃~+155℃
R14 = RC1206FR-07220RL: Type:Thick Film Resistors Resistance: Tolerance:±1% Tolerance:±1% Power(Watts):250mW Overload Voltage (Max): Temperature Coefficient:±100ppm/℃ Temperature Coefficient:±100ppm/℃ Operating Temperature Range:-55℃~+155℃ Operating Temperature Range:-55℃~+155℃; LCSC Part Name: 厚膜电阻 220Ω ±1% 250mW; Supplier Part: C137353; Manufacturer: YAGEO(国巨); Supplier Footprint: 1206; JLCPCB Part Class: Extended Part; Datasheet: https://atta.szlcsc.com/upload/public/pdf/source/20180821/C275644_0D56F95EFF785E7D9A1FEF436B37DA78.pdf; Supplier: LCSC; Type: Thick Film Resistors; Tolerance: ±1%; Power(Watts): 250mW; Temperature Coefficient: ±100ppm/℃; Operating Temperature Range: -55℃~+155℃
R19 = 3296W-1-302LF_C780123: Resistance: Tolerance:±10% Tolerance:±10% Power(Watts):500mW Turns:; LCSC Part Name: 3kΩ ±10%; Supplier Part: C780123; Manufacturer: BOURNS; Manufacturer Part: 3296W-1-302LF; Supplier Footprint: SIP-3P,9.5x4.8mm; JLCPCB Part Class: Extended Part; Datasheet: https://atta.szlcsc.com/upload/public/pdf/source/20200907/C780107_B10DBBD0C4B43BFA1FDAF98D4F88F255.pdf; Supplier: LCSC; Tolerance: ±10%; Power(Watts): 500mW
R20 = FRC1206F2002TS: Type:Thick Film Resistor Resistance:20kΩ Tolerance:±1% Tolerance:±1% Power(Watts):250mW Voltage-Supply(Max):200V Temperature Coefficient:±100ppm/℃ Temperature Coefficient:±100ppm/℃ Operating Temperature:-55℃~+155℃ Operating Temperature:-55℃~+155℃; LCSC Part Name: 20kΩ ±1% 250mW 厚膜电阻; Supplier Part: C2933636; Manufacturer: FOJAN(富捷); Supplier Footprint: 1206; JLCPCB Part Class: Extended Part; Supplier: LCSC; Type: Thick Film Resistor; Tolerance: ±1%; Power(Watts): 250mW; Voltage-Supply(Max): 200V; Temperature Coefficient: ±100ppm/℃; Operating Temperature: -55℃~+155℃
R23 R24 = FRC2512J512 TS: Type:Thick Film Resistor Resistance:5.1kΩ Tolerance:±5% Tolerance:±5% Power(Watts):1W Voltage-Supply(Max):200V Temperature Coefficient:±100ppm/℃ Temperature Coefficient:±100ppm/℃ Operating Temperature:-55℃~+155℃ Operating Temperature:-55℃~+155℃; LCSC Part Name: 5.1kΩ ±5% 1W 厚膜电阻; Supplier Part: C2934122; Manufacturer: FOJAN(富捷); Supplier Footprint: 2512; JLCPCB Part Class: Extended Part; Supplier: LCSC; Type: Thick Film Resistor; Tolerance: ±5%; Power(Watts): 1W; Voltage-Supply(Max): 200V; Temperature Coefficient: ±100ppm/℃; Operating Temperature: -55℃~+155℃
R25 R26 = FRC1206F10R0TS: Type:Thick Film Resistor Resistance:10Ω Tolerance:±1% Tolerance:±1% Power(Watts):250mW Voltage-Supply(Max):200V Temperature Coefficient:±200ppm/℃ Temperature Coefficient:±200ppm/℃ Operating Temperature:-55℃~+155℃ Operating Temperature:-55℃~+155℃; LCSC Part Name: 10Ω ±1% 250mW 厚膜电阻; Supplier Part: C2907371; Manufacturer: FOJAN(富捷); Supplier Footprint: 1206; JLCPCB Part Class: Extended Part; Supplier: LCSC; Type: Thick Film Resistor; Tolerance: ±1%; Power(Watts): 250mW; Voltage-Supply(Max): 200V; Temperature Coefficient: ±200ppm/℃; Operating Temperature: -55℃~+155℃
REL1 = JY32FNH-SH-DC12V-A/20A: Coil Voltage:12V Contact Form:1 Form A: 1A (SPST-NO) Number of Pins:4 Contact Rating:20A@250VAC Switching Voltage(Max):277V@AC；30V@DC Coil Rated Power:200mW Contact Material:Silver Alloy Switching Current(Max):20A Coil Resistance:720Ω Contact Resistance:1; Supplier Part: C17702416; Manufacturer: JY(杰盈电器); Supplier Footprint: 插件,18.2x10.2mm; JLCPCB Part Class: Extended Part; Datasheet: https://item.szlcsc.com/datasheet/JY32FNH-SH-DC12V-A%252F20A/18840259.html; Supplier: LCSC; Coil Voltage: 12V; Contact Form: 1 Form A: 1A (SPST-NO); Number of Pins: 4; Contact Rating: 20A@250VAC; Switching Voltage(Max): 277V@AC；30V@DC; Coil Rated Power: 200mW; Contact Material: Silver Alloy; Switching Current(Max): 20A; Coil Resistance: 720Ω; Contact Resistance: 100mΩ; Operate Time: 10ms; Release Time: 10ms; Operating Temperature: -40℃~+85℃
SH1 SH2 = Y110-5-20J-t1: Type:Current Sense Resistor Resistance:20mΩ Tolerance:±5% Tolerance:±5% Voltage Rating:- Power(Watts):10W Current Rating:- Temperature Coefficient:- Temperature Coefficient:- Mounting Type:Through Hole; LCSC Part Name: 20mΩ ±5% 10W; Supplier Part: C695785; Manufacturer: yezhan(业展); Supplier Footprint: 插件,P=5mm; JLCPCB Part Class: Extended Part; Datasheet: https://item.szlcsc.com/datasheet/Y110-5-20J-t1/729437.html; Supplier: LCSC; Type: Current Sense Resistor; Tolerance: ±5%; Power(Watts): 10W; Mounting Type: Through Hole
T1 = ETD59 15+15:45 50A HPWR
T2 = XREE13-050622: Primary Winding(s):2 Secondary Winding:1 Isolation Voltage(Vrms):3.75kV Inductance:5mH; LCSC Part Name: XREE13 卧式  单边加长5+2  5.0mH; Supplier Part: C49118509; Manufacturer: XR(祥如); Supplier Footprint: 插件; JLCPCB Part Class: Extended Part; Datasheet: https://item.szlcsc.com/datasheet/XREE13-050622/51502685.html; Supplier: LCSC; Primary Winding(s): 2; Secondary Winding: 1; Isolation Voltage(Vrms): 3.75kV
T3 = GDT - HPWR SMPS V1
U1 = TEA2096T/1J: Supplier Part: C5365715; Manufacturer: NXP(恩智浦); Supplier Footprint: SOIC-8; JLCPCB Part Class: Extended Part; Datasheet: https://www.nxp.com/docs/en/data-sheet/TEA2096T.pdf; Supplier: LCSC
U12 = DP1801B: Voltage - Supply:4.5V~23V Voltage - Supply:4.5V~23V Frequency - Switching:35kHz~70kHz Frequency - Switching:35kHz~70kHz Voltage - Breakdown:800V Features:Constant Voltage (CV)；Under Voltage Protection；Over Temperature Protection；Constant Current Mode (CC); LCSC Part Name: 准谐振原边反馈恒流/恒压PWM电源开关; Supplier Part: C2967747; Manufacturer: 德普微电子; Supplier Footprint: SOP-7; JLCPCB Part Class: Extended Part; Datasheet: https://item.szlcsc.com/datasheet/DP1801B/3360172.html; Supplier: LCSC; Voltage - Supply: 4.5V~23V; Frequency - Switching: 35kHz~70kHz; Voltage - Breakdown: 800V; Features: Constant Voltage (CV)；Under Voltage Protection；Over Temperature Protection；Constant Current Mode (CC)；Short Circuit Protection；Over Voltage Protection；Over Current Protection; Operating Temperature: -40℃~+85℃; Working Mode: PFM Modulation；QR; Feedback System: Primary-Side Feedback
U25 = KF78C-13.0-2P: Barrier Type:With Cover Plate Pitch:13mm Number of Positions or Pins:1x2P Mounting Type:Straight Pin Location:Mid Terminal Number of Pins:2P Number of Rows:1 Number of PINs Per Row:2 Current Rating:40A Voltage Rating (Max):750V Wire Gauge - AWG:10~18 Wire; LCSC Part Name: 13mm 1x2P 直插 中脚 排数:1 每排P数:2; Supplier Part: C707721; Manufacturer: KEFA(科发); Supplier Footprint: 插件,P=13mm; JLCPCB Part Class: Extended Part; Datasheet: https://item.szlcsc.com/datasheet/KF78C-13.0-2P/744930.html; Supplier: LCSC; Barrier Type: With Cover Plate; Pitch: 13mm; Number of Positions or Pins: 1x2P; Mounting Type: Straight; Pin Location: Mid Terminal; Number of Pins: 2P; Number of Rows: 1; Number of PINs Per Row: 2; Current Rating: 40A; Voltage Rating (Max): 750V; Wire Gauge - AWG: 10~18; Wire Gauge - mm2: 6; Operating Temperature: -40℃~+105℃; Color: Black
U33 = LM317HVT/NOPB: Output Type: Maximum Input Voltage:60V Output Voltage:1.25V~57V Output Voltage:1.25V~57V MAX Output Current:1.5A Power Supply Rejection Ratio (PSRR):80dB@(120Hz) Dropout Voltage:- standby current:12mA Operating Temperature:0℃~+125℃ Operating Temperature:0; LCSC Part Name: ADJ 输入60V 输出1.25V~57V 1.5A; Supplier Part: C468256; Manufacturer: TI(德州仪器); Supplier Footprint: TO-220; JLCPCB Part Class: Extended Part; Datasheet: https://www.ti.com/cn/lit/gpn/lm317hv; Supplier: LCSC; Maximum Input Voltage: 60V; Output Voltage: 1.25V~57V; MAX Output Current: 1.5A; Power Supply Rejection Ratio (PSRR): 80dB@(120Hz); standby current: 12mA; Operating Temperature: 0℃~+125℃; Output Polarity: Positive electrode; Number of Outputs: 1
V1 = FTR14D391K: Varistor Voltage:351V~429V Varistor Voltage:351V~429V Clamping Voltage:650V Maximum DC Volts:320V Maximum AC Volts:250V Peak Current:4.5kA Energy:100J Energy:100J Capacitance:-; LCSC Part Name: 钳位电压650V 100焦耳 插件压敏电阻; Supplier Part: C693565; Manufacturer: FTR(乔光电子); Supplier Footprint: 插件,P=7.5mm; JLCPCB Part Class: Extended Part; Datasheet: https://item.szlcsc.com/datasheet/FTR14D391K/725927.html; Supplier: LCSC; Varistor Voltage: 351V~429V; Clamping Voltage: 650V; Maximum DC Volts: 320V; Maximum AC Volts: 250V; Peak Current: 4.5kA; Energy: 100J

## Nets
+12V: C20.1 CN1.1 CN6.2 D11.1(K) R14.1 R20.1 REL1.1 U33.2(OUT)
AGND: C1.2 C2.2 C3.2 C4.2 C5.2 C6.2 C8.1 C16.2 C17.2 D1.1(-) D7.2(A) H3.1 Q2.3(S) R1.1 R12.1 R19.1 R19.2 T2.1 T3.3 U12.7(GND)
GND: C15.2 C19.2 C20.2 C27.2 C28.2 C29.2 C30.2 C31.2 C32.1 C33.2 CN1.2 CN6.1 D10.2 D12.2 H2.1 Q5.2(S) Q7.3(S) Q8.3(S) R13.2 R22.1 SH1.1 SH2.1 T2.6 U1.2(GND) U1.4(SSB) U1.5(SSA)
GNDHV: C13.1 C14.2
HV_OUT: C1.1 C2.1 C3.1 C4.1 C5.1 C6.1 C7.2 C18.1 CN3.1 H4.1 Q1.2(D) R2.2 R8.1 R10.1 T2.3
OUT: C27.1 C28.1 C29.1 C30.1 C31.1 H2.3 L2.1 U25.2
$1N15941: HS1.1 Q8.2(D) R26.2 T1.3 U1.3(DSB)
$1N17716: L2.2 R23.2 R24.2 T1.4
$1N18138: HS2.1 Q7.2(D) R25.2 T1.5 U1.6(DSA)
$1N23331: H2.2 SH1.2 SH2.2 U25.1
$1N24917: D9.2(A) T2.7
$1N24919: D8.2(A) T2.5 U12.5(HV) U12.6(HV)
$1N24944: R12.2 U12.4(CS)
$1N24945: D6.2(A) R11.2 T2.2
$1N24947: C18.2 D8.1(K) R10.2
$1N24949: R8.2 R9.2
$1N24950: D7.1(C) R11.1 R19.3 U12.2(FB)
$1N24951: C17.1 D6.1(K) R9.1 U12.1(VDD)
$1N41116: C19.1 D9.1(K) D10.1 U33.3(IN)
$1N41179: R13.1 R14.2 U33.1(ADJ)
$1N50810: C11.2 FH1.2 L1.1
$1N50811: C11.1 L1.4 R4.2 REL1.2
$1N50814: C13.2 CN5.2 FH1.1
$1N50815: C14.1 CN5.1 R4.1 REL1.3
$1N50817: C9.2 C10.2 Q1.3(S) Q2.2(D) T3.1
$1N50828: C7.1 C8.2 R1.2 R2.1 T1.1
$1N50846: C9.1 C10.1 T1.2
$1N50849: Q1.1(G) T3.2
$1N50850: CN4.2 T3.5
$1N50852: CN4.1 T3.6
$1N50853: Q2.1(G) T3.4
$1N50854: C12.1 D1.3(AC) L1.3 V1.2
$1N50860: C12.2 D1.2(AC) L1.2 V1.1
$1N50865: C16.1 CN3.2 D1.4(+)
$1N53315: D11.2(A) Q5.3(D) REL1.4
$1N53324: C15.1 Q5.1(G) R20.2 R22.2
$1N53830: Q8.1(G) U1.1(GDB)
$1N53854: D12.1 R23.1 R24.1 U1.7(VCC)
$1N53858: Q7.1(G) U1.8(GDA)
$1N59196: C32.2 R26.1
$1N59232: C33.1 R25.1

Not connected (* = marked no-connect by the designer): CN5 3 4; HS3 1; U12 3(NC)

## Notes on the sheet
- TO INPUT
  CONNECTOR
- KF78C-13.0-4P
